# Altium schematic sheet 03 CPU.SchDoc
size 420 x 297 mm
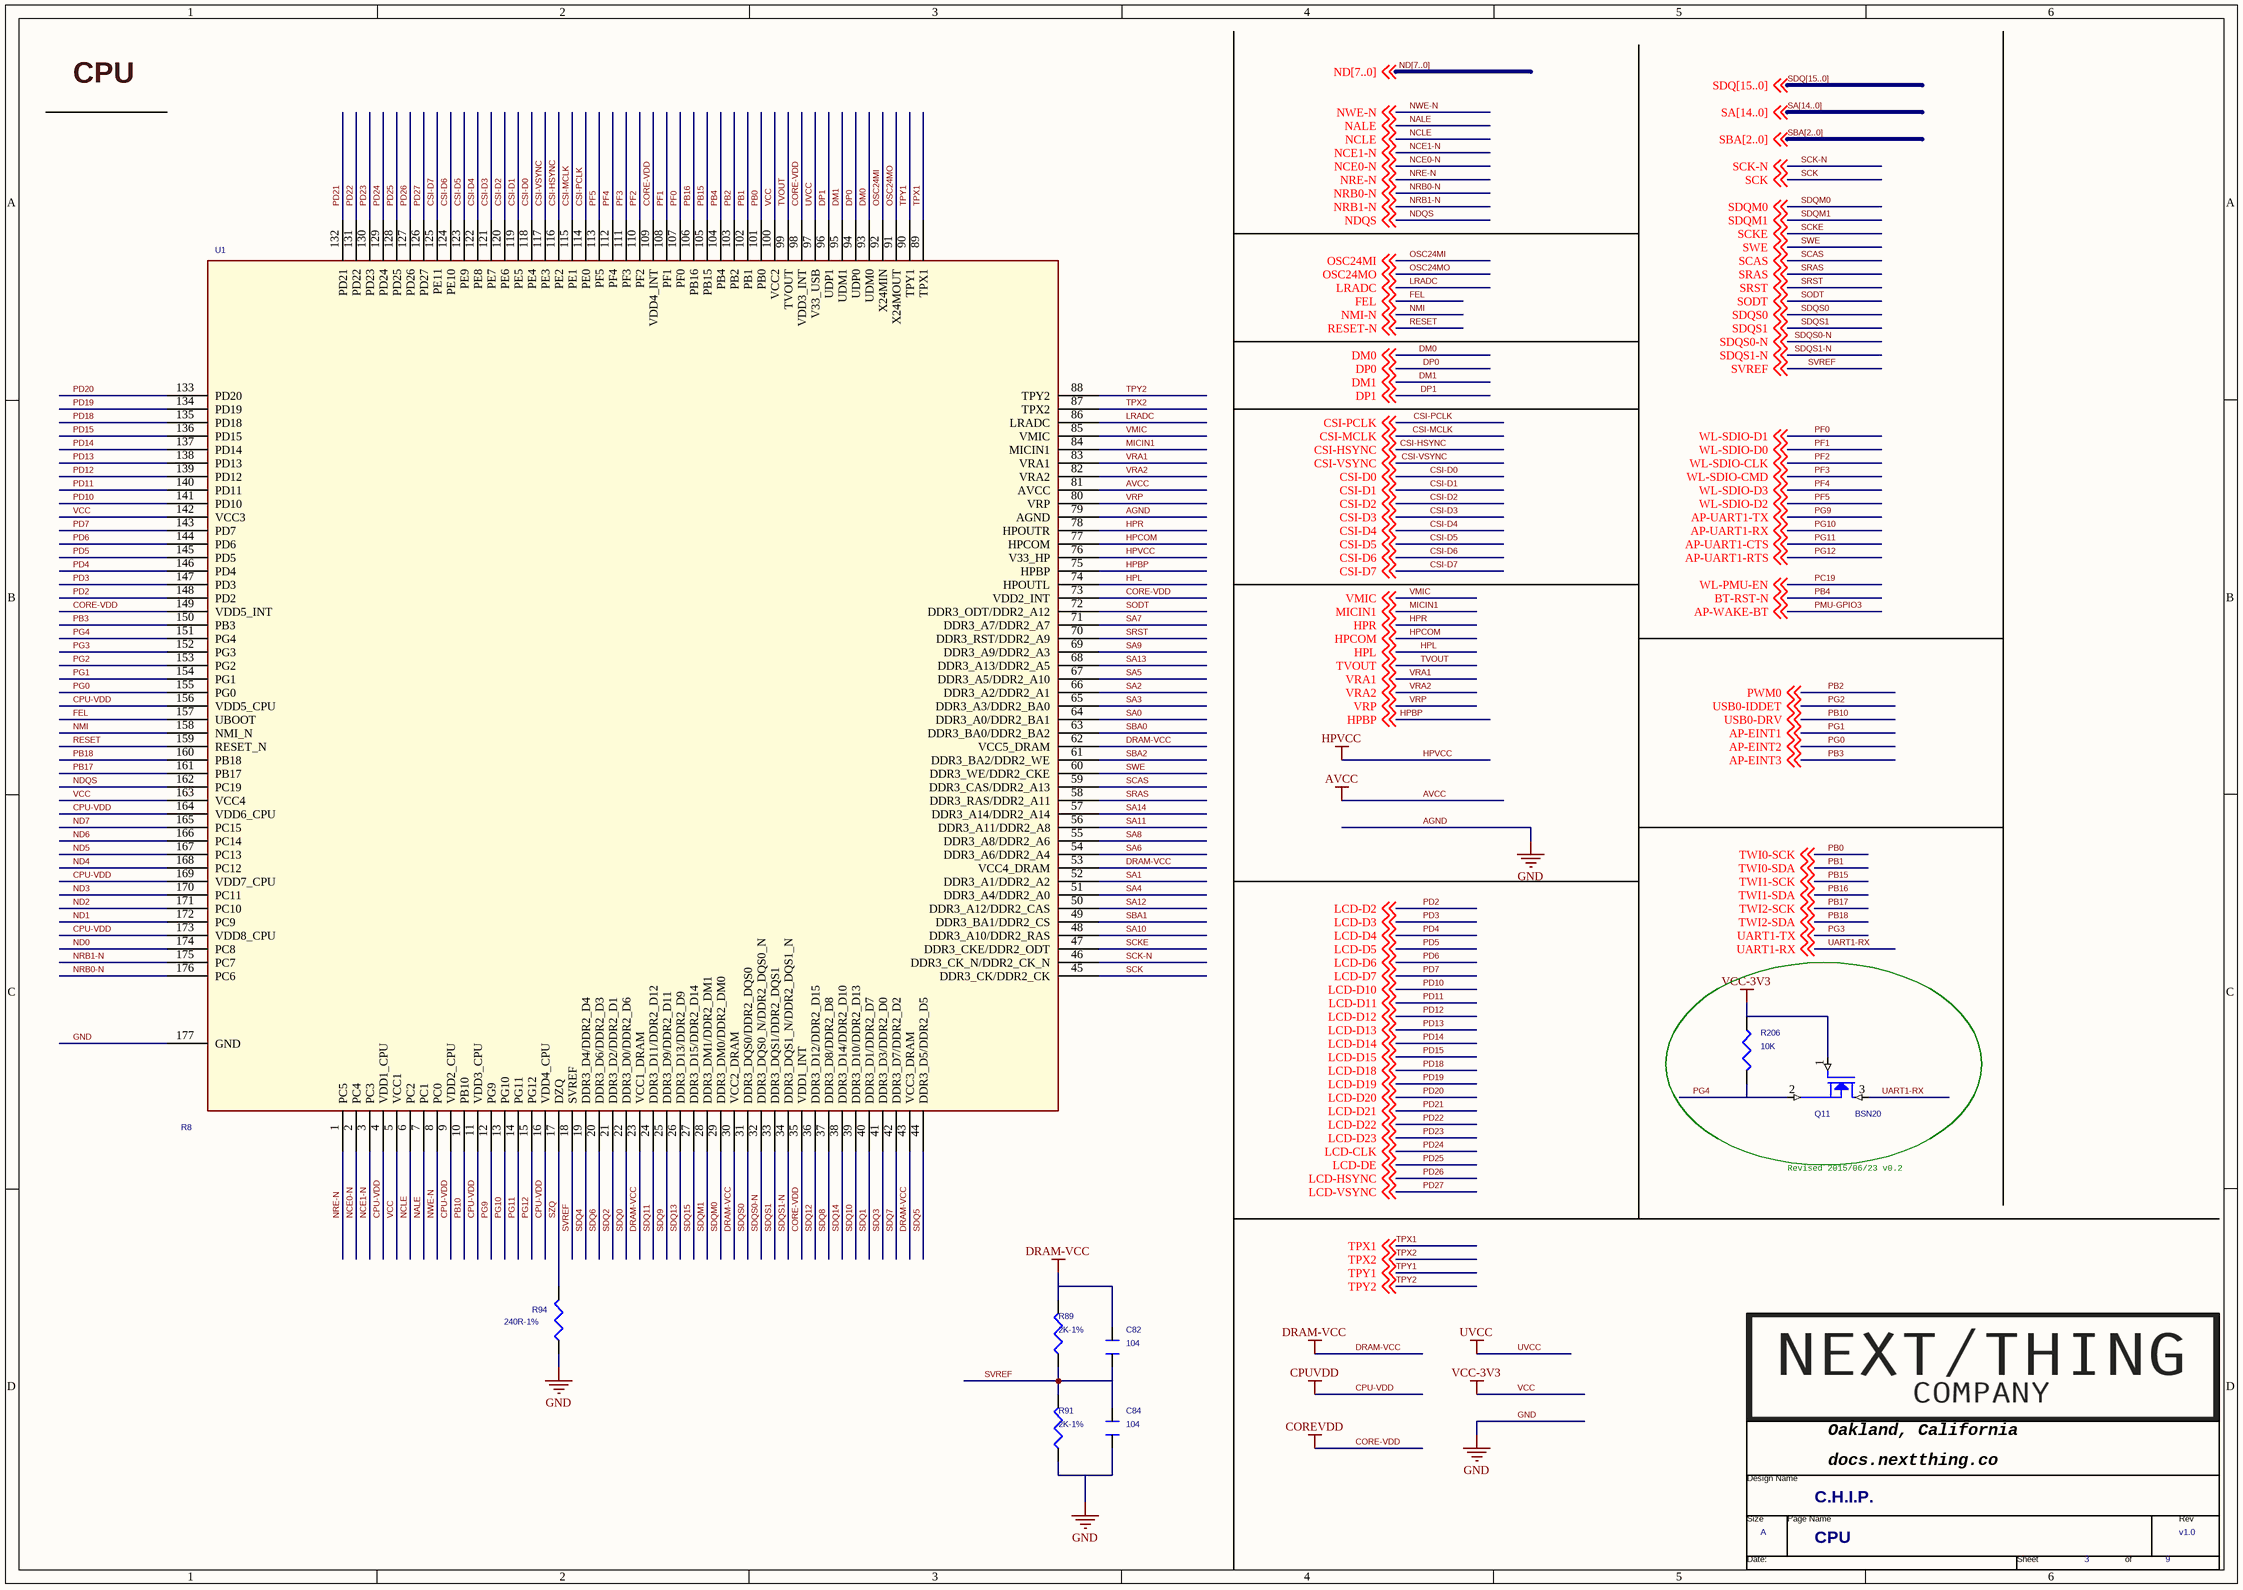
[diagram p0: 03 CPU.SchDoc]

## Parts
*  Page Count: 9  Page Number: 3  Page Size: A  Title: C.H.I.P.  RevCode: v1.0  Doc: CPU  (hidden comment: TitleBlock1-nextthing)  (graphical)
C82  104  [0805]
C84  104  [0805]
Q11  BSN20  [sot-23]
R89  2K-1%  [0805]
R91  2K-1%  [0805]
R94  240R-1%  [C0201]
R206  10K  [0805]
U1  R8  [TQFP177P0_4]

## Nets
AGND: C84.2 R91.1 R94.1 U1.79(AGND) U1.177(GND)  [also labelled GND]
AVCC: U1.81(AVCC)
CORE-VDD: U1.35(VDD1_INT) U1.73(VDD2_INT) U1.98(VDD3_INT) U1.109(VDD4_INT) U1.149(VDD5_INT)  [also labelled COREVDD]
CPU-VDD: U1.4(VDD1_CPU) U1.9(VDD2_CPU) U1.11(VDD3_CPU) U1.16(VDD4_CPU) U1.156(VDD5_CPU) U1.164(VDD6_CPU) U1.169(VDD7_CPU) U1.173(VDD8_CPU)  [also labelled CPUVDD]
DRAM-VCC: C82.1 R89.2 U1.23(VCC1_DRAM) U1.30(VCC2_DRAM) U1.43(VCC3_DRAM) U1.53(VCC4_DRAM) U1.62(VCC5_DRAM)
HPVCC: U1.76(V33_HP)
UVCC: U1.97(V33_USB)
VCC: Q11.1(GATE) R206.1 U1.5(VCC1) U1.100(VCC2) U1.142(VCC3) U1.163(VCC4)  [also labelled VCC-3V3]
CSI-D0: U1.118(PE4) ; off-sheet CSI-D0
CSI-D1: U1.119(PE5) ; off-sheet CSI-D1
CSI-D2: U1.120(PE6) ; off-sheet CSI-D2
CSI-D3: U1.121(PE7) ; off-sheet CSI-D3
CSI-D4: U1.122(PE8) ; off-sheet CSI-D4
CSI-D5: U1.123(PE9) ; off-sheet CSI-D5
CSI-D6: U1.124(PE10) ; off-sheet CSI-D6
CSI-D7: U1.125(PE11) ; off-sheet CSI-D7
CSI-HSYNC: U1.116(PE2) ; off-sheet CSI-HSYNC
CSI-MCLK: U1.115(PE1) ; off-sheet CSI-MCLK
CSI-PCLK: U1.114(PE0) ; off-sheet CSI-PCLK
CSI-VSYNC: U1.117(PE3) ; off-sheet CSI-VSYNC
DM0: U1.93(UDM0) ; off-sheet DM0
DM1: U1.95(UDM1) ; off-sheet DM1
DP0: U1.94(UDP0) ; off-sheet DP0
DP1: U1.96(UDP1) ; off-sheet DP1
FEL: U1.157(UBOOT) ; off-sheet FEL
HPBP: U1.75(HPBP) ; off-sheet HPBP
HPCOM: U1.77(HPCOM) ; off-sheet HPCOM
HPL: U1.74(HPOUTL) ; off-sheet HPL
HPR: U1.78(HPOUTR) ; off-sheet HPR
LRADC: U1.86(LRADC) ; off-sheet LRADC
MICIN1: U1.84(MICIN1) ; off-sheet MICIN1
NALE: U1.7(PC1) ; off-sheet NALE
NCE0-N: U1.2(PC4) ; off-sheet NCE0-N
NCE1-N: U1.3(PC3) ; off-sheet NCE1-N
NCLE: U1.6(PC2) ; off-sheet NCLE
ND0: U1.174(PC8)
ND1: U1.172(PC9)
ND2: U1.171(PC10)
ND3: U1.170(PC11)
ND4: U1.168(PC12)
ND5: U1.167(PC13)
ND6: U1.166(PC14)
ND7: U1.165(PC15)
NDQS: U1.162(PC19) ; off-sheet NDQS
NMI: U1.158(NMI_N) ; off-sheet NMI-N  [also labelled NMI-N]
NRB0-N: U1.176(PC6) ; off-sheet NRB0-N
NRB1-N: U1.175(PC7) ; off-sheet NRB1-N
NRE-N: U1.1(PC5) ; off-sheet NRE-N
NWE-N: U1.8(PC0) ; off-sheet NWE-N
OSC24MI: U1.92(X24MIN) ; off-sheet OSC24MI
OSC24MO: U1.91(X24MOUT) ; off-sheet OSC24MO
PB0: U1.101(PB0) ; off-sheet TWI0-SCK  [also labelled TWI0-SCK]
PB1: U1.102(PB1) ; off-sheet TWI0-SDA  [also labelled TWI0-SDA]
PB2: U1.103(PB2) ; off-sheet PWM0  [also labelled PWM0]
PB3: U1.150(PB3) ; off-sheet AP-EINT3  [also labelled AP-EINT3]
PB4: U1.104(PB4) ; off-sheet BT-RST-N  [also labelled BT-RST-N]
PB10: U1.10(PB10) ; off-sheet USB0-DRV  [also labelled USB0-DRV]
PB15: U1.105(PB15) ; off-sheet TWI1-SCK  [also labelled TWI1-SCK]
PB16: U1.106(PB16) ; off-sheet TWI1-SDA  [also labelled TWI1-SDA]
PB17: U1.161(PB17) ; off-sheet TWI2-SCK  [also labelled TWI2-SCK]
PB18: U1.160(PB18) ; off-sheet TWI2-SDA  [also labelled TWI2-SDA]
PD2: U1.148(PD2) ; off-sheet LCD-D2  [also labelled LCD-D2]
PD3: U1.147(PD3) ; off-sheet LCD-D3  [also labelled LCD-D3]
PD4: U1.146(PD4) ; off-sheet LCD-D4  [also labelled LCD-D4]
PD5: U1.145(PD5) ; off-sheet LCD-D5  [also labelled LCD-D5]
PD6: U1.144(PD6) ; off-sheet LCD-D6  [also labelled LCD-D6]
PD7: U1.143(PD7) ; off-sheet LCD-D7  [also labelled LCD-D7]
PD10: U1.141(PD10) ; off-sheet LCD-D10  [also labelled LCD-D10]
PD11: U1.140(PD11) ; off-sheet LCD-D11  [also labelled LCD-D11]
PD12: U1.139(PD12) ; off-sheet LCD-D12  [also labelled LCD-D12]
PD13: U1.138(PD13) ; off-sheet LCD-D13  [also labelled LCD-D13]
PD14: U1.137(PD14) ; off-sheet LCD-D14  [also labelled LCD-D14]
PD15: U1.136(PD15) ; off-sheet LCD-D15  [also labelled LCD-D15]
PD18: U1.135(PD18) ; off-sheet LCD-D18  [also labelled LCD-D18]
PD19: U1.134(PD19) ; off-sheet LCD-D19  [also labelled LCD-D19]
PD20: U1.133(PD20) ; off-sheet LCD-D20  [also labelled LCD-D20]
PD21: U1.132(PD21) ; off-sheet LCD-D21  [also labelled LCD-D21]
PD22: U1.131(PD22) ; off-sheet LCD-D22  [also labelled LCD-D22]
PD23: U1.130(PD23) ; off-sheet LCD-D23  [also labelled LCD-D23]
PD24: U1.129(PD24) ; off-sheet LCD-CLK  [also labelled LCD-CLK]
PD25: U1.128(PD25) ; off-sheet LCD-DE  [also labelled LCD-DE]
PD26: U1.127(PD26) ; off-sheet LCD-HSYNC  [also labelled LCD-HSYNC]
PD27: U1.126(PD27) ; off-sheet LCD-VSYNC  [also labelled LCD-VSYNC]
PF0: U1.107(PF0) ; off-sheet WL-SDIO-D1  [also labelled WL-SDIO-D1]
PF1: U1.108(PF1) ; off-sheet WL-SDIO-D0  [also labelled WL-SDIO-D0]
PF2: U1.110(PF2) ; off-sheet WL-SDIO-CLK  [also labelled WL-SDIO-CLK]
PF3: U1.111(PF3) ; off-sheet WL-SDIO-CMD  [also labelled WL-SDIO-CMD]
PF4: U1.112(PF4) ; off-sheet WL-SDIO-D3  [also labelled WL-SDIO-D3]
PF5: U1.113(PF5) ; off-sheet WL-SDIO-D2  [also labelled WL-SDIO-D2]
PG0: U1.155(PG0) ; off-sheet AP-EINT2  [also labelled AP-EINT2]
PG1: U1.154(PG1) ; off-sheet AP-EINT1  [also labelled AP-EINT1]
PG2: U1.153(PG2) ; off-sheet USB0-IDDET  [also labelled USB0-IDDET]
PG3: U1.152(PG3) ; off-sheet UART1-TX  [also labelled UART1-TX]
PG4: Q11.2(SOURCE) R206.2 U1.151(PG4)
PG9: U1.12(PG9) ; off-sheet AP-UART1-TX  [also labelled AP-UART1-TX]
PG10: U1.13(PG10) ; off-sheet AP-UART1-RX  [also labelled AP-UART1-RX]
PG11: U1.14(PG11) ; off-sheet AP-UART1-CTS  [also labelled AP-UART1-CTS]
PG12: U1.15(PG12) ; off-sheet AP-UART1-RTS  [also labelled AP-UART1-RTS]
RESET: U1.159(RESET_N) ; off-sheet RESET-N  [also labelled RESET-N]
SA0: U1.64(DDR3_A0/DDR2_BA1)
SA1: U1.52(DDR3_A1/DDR2_A2)
SA2: U1.66(DDR3_A2/DDR2_A1)
SA3: U1.65(DDR3_A3/DDR2_BA0)
SA4: U1.51(DDR3_A4/DDR2_A0)
SA5: U1.67(DDR3_A5/DDR2_A10)
SA6: U1.54(DDR3_A6/DDR2_A4)
SA7: U1.71(DDR3_A7/DDR2_A7)
SA8: U1.55(DDR3_A8/DDR2_A6)
SA9: U1.69(DDR3_A9/DDR2_A3)
SA10: U1.48(DDR3_A10/DDR2_RAS)
SA11: U1.56(DDR3_A11/DDR2_A8)
SA12: U1.50(DDR3_A12/DDR2_CAS)
SA13: U1.68(DDR3_A13/DDR2_A5)
SA14: U1.57(DDR3_A14/DDR2_A14)
SBA0: U1.63(DDR3_BA0/DDR2_BA2)
SBA1: U1.49(DDR3_BA1/DDR2_CS)
SBA2: U1.61(DDR3_BA2/DDR2_WE)
SCAS: U1.59(DDR3_CAS/DDR2_A13) ; off-sheet SCAS
SCK: U1.45(DDR3_CK/DDR2_CK) ; off-sheet SCK
SCK-N: U1.46(DDR3_CK_N/DDR2_CK_N) ; off-sheet SCK-N
SCKE: U1.47(DDR3_CKE/DDR2_ODT) ; off-sheet SCKE
SDQ0: U1.22(DDR3_D0/DDR2_D6)
SDQ1: U1.40(DDR3_D1/DDR2_D7)
SDQ2: U1.21(DDR3_D2/DDR2_D1)
SDQ3: U1.41(DDR3_D3/DDR2_D0)
SDQ4: U1.19(DDR3_D4/DDR2_D4)
SDQ5: U1.44(DDR3_D5/DDR2_D5)
SDQ6: U1.20(DDR3_D6/DDR2_D3)
SDQ7: U1.42(DDR3_D7/DDR2_D2)
SDQ8: U1.37(DDR3_D8/DDR2_D8)
SDQ9: U1.25(DDR3_D9/DDR2_D11)
SDQ10: U1.39(DDR3_D10/DDR2_D13)
SDQ11: U1.24(DDR3_D11/DDR2_D12)
SDQ12: U1.36(DDR3_D12/DDR2_D15)
SDQ13: U1.26(DDR3_D13/DDR2_D9)
SDQ14: U1.38(DDR3_D14/DDR2_D10)
SDQ15: U1.27(DDR3_D15/DDR2_D14)
SDQM0: U1.29(DDR3_DM0/DDR2_DM0) ; off-sheet SDQM0
SDQM1: U1.28(DDR3_DM1/DDR2_DM1) ; off-sheet SDQM1
SDQS0: U1.31(DDR3_DQS0/DDR2_DQS0) ; off-sheet SDQS0
SDQS0-N: U1.32(DDR3_DQS0_N/DDR2_DQS0_N) ; off-sheet SDQS0-N
SDQS1: U1.33(DDR3_DQS1/DDR2_DQS1) ; off-sheet SDQS1
SDQS1-N: U1.34(DDR3_DQS1_N/DDR2_DQS1_N) ; off-sheet SDQS1-N
SODT: U1.72(DDR3_ODT/DDR2_A12) ; off-sheet SODT
SRAS: U1.58(DDR3_RAS/DDR2_A11) ; off-sheet SRAS
SRST: U1.70(DDR3_RST/DDR2_A9) ; off-sheet SRST
SVREF: C82.2 C84.1 R89.1 R91.2 U1.18(SVREF) ; off-sheet SVREF
SWE: U1.60(DDR3_WE/DDR2_CKE) ; off-sheet SWE
SZQ: R94.2 U1.17(DZQ)
TPX1: U1.89(TPX1) ; off-sheet TPX1
TPX2: U1.87(TPX2) ; off-sheet TPX2
TPY1: U1.90(TPY1) ; off-sheet TPY1
TPY2: U1.88(TPY2) ; off-sheet TPY2
TVOUT: U1.99(TVOUT) ; off-sheet TVOUT
UART1-RX: Q11.3(DRAIN) ; off-sheet UART1-RX
VMIC: U1.85(VMIC) ; off-sheet VMIC
VRA1: U1.83(VRA1) ; off-sheet VRA1
VRA2: U1.82(VRA2) ; off-sheet VRA2
VRP: U1.80(VRP) ; off-sheet VRP

## Buses and harness runs
bus ND[7..0]
bus SA[14..0]
bus SBA[2..0]
bus SDQ[15..0]

## Notes on the sheet
- CPU
- Revised 2015/06/23 v0.2
- (in symbol TitleBlock1-nextthing) Oakland, California; Design Name; docs.nextthing.co /; Size; Page Name; Rev; Date:; Sheet; of

## Library data of the parts
C82 C84 = CAP_0
Q11 = NMOS_xp151_SOT23
R89 R91 = R1 0805
R94 = R_Dup2
R206 = R1_0805: ROOM: DRAM
U1 = AW1625_CSI_eLQFP176_3
* = TitleBlock1-nextthing: Page Create Date: March  8, 1995